# EAGLE design vr01-revC (EAGLE 9.6.2)
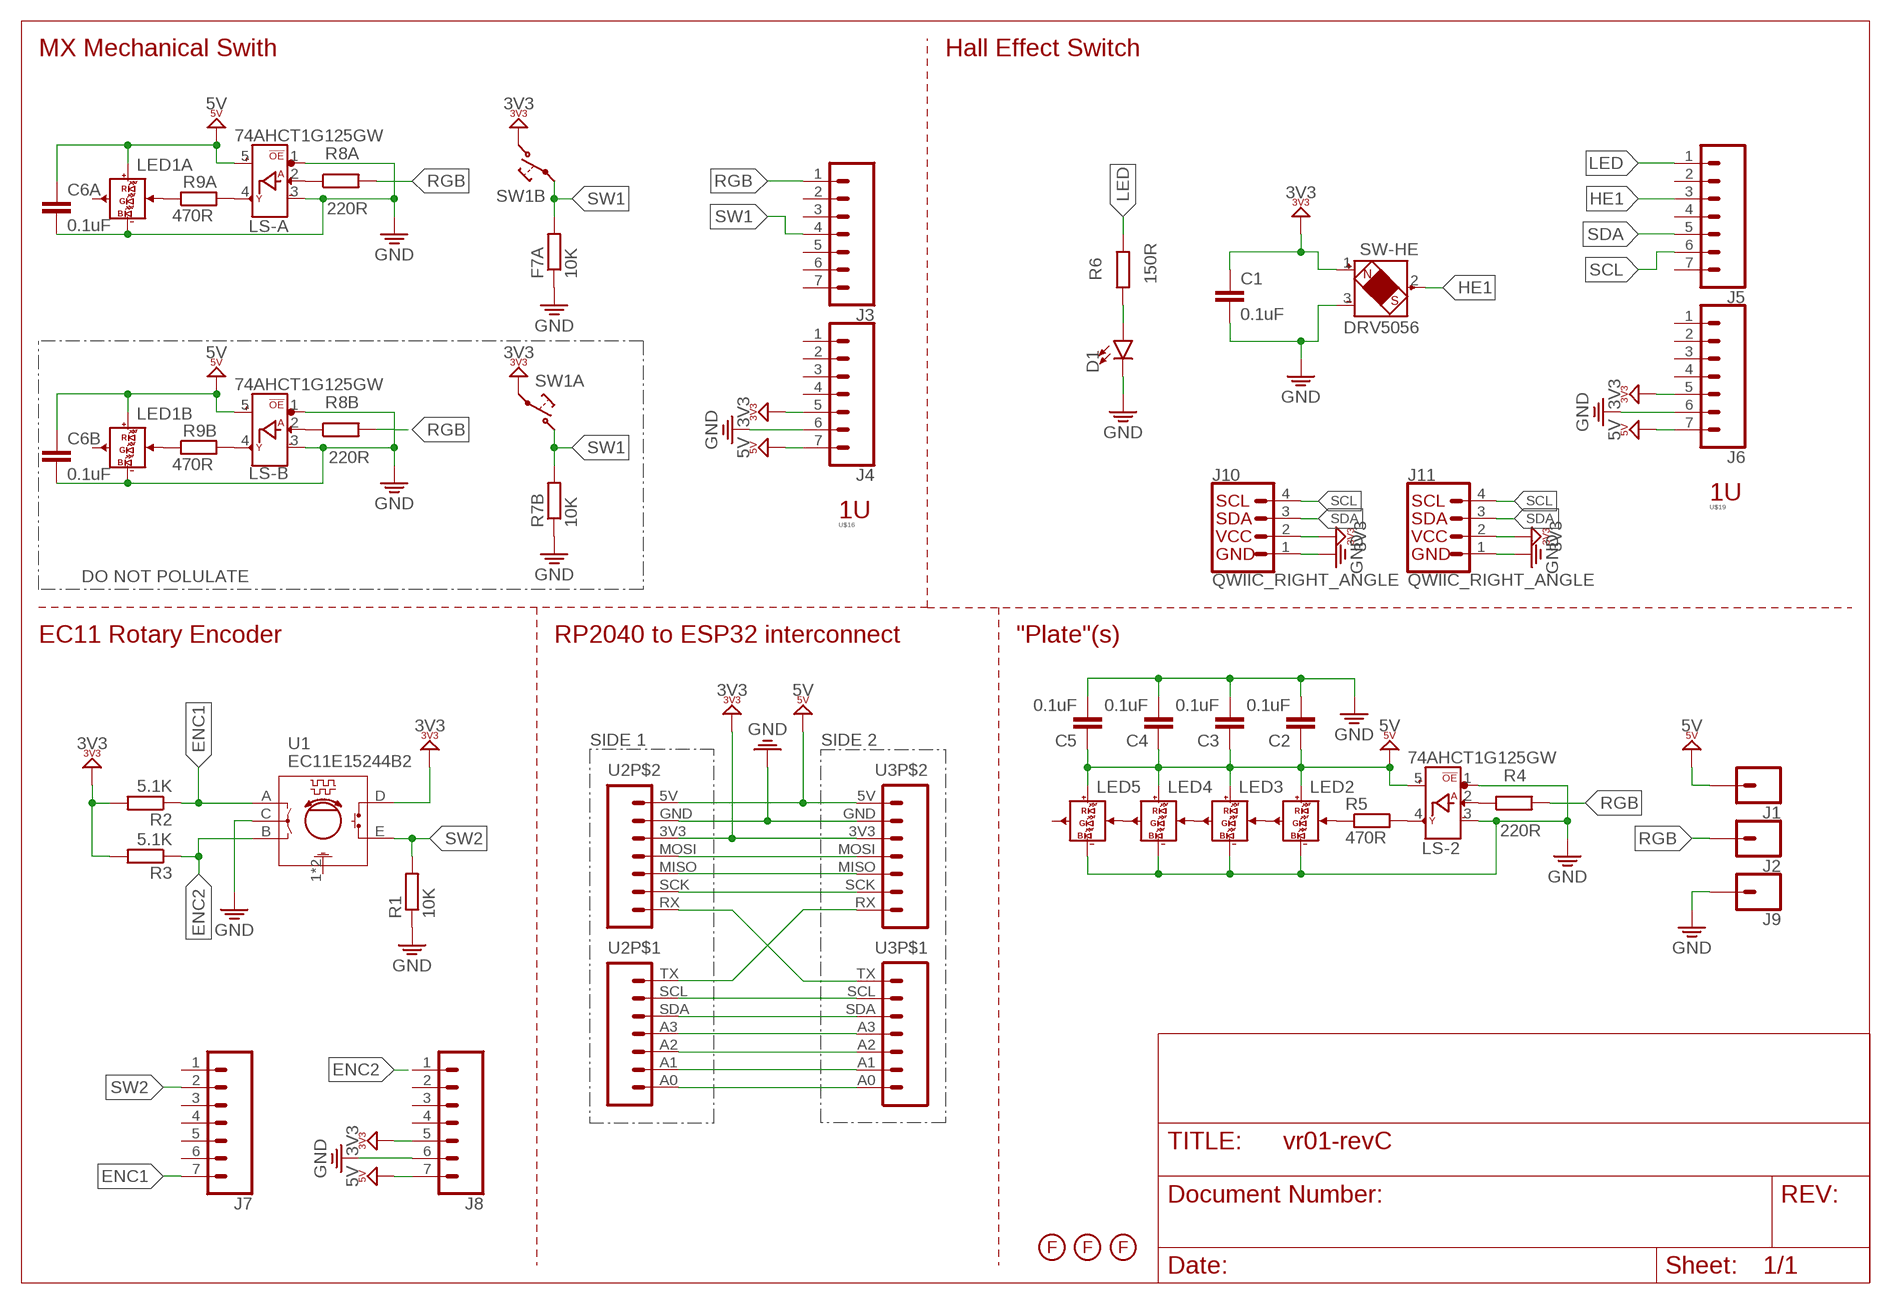
[diagram p0: schematic, sheet 1]

## Parts
C1  0.1uF  C-EUC0603  [C0603]
C2  0.1uF  C-EUC0603  [C0603]
C3  0.1uF  C-EUC0603  [C0603]
C4  0.1uF  C-EUC0603  [C0603]
C5  0.1uF  C-EUC0603  [C0603]
C6A  0.1uF  C-EUC0603  [C0603]
C6B  0.1uF  C-EUC0603  [C0603]
D1  LED1206-BOTTOM  [LED-1206-BOTTOM]
F7A  10K  R-EU_R0603  [R0603]
J1  CONN_01PTH_NO_SILK_STAND  [1X01_NO_SILK_STAND]
J2  CONN_01PTH_NO_SILK_STAND  [1X01_NO_SILK_STAND]
J3  CONN_07  [1X07]
J4  CONN_07  [1X07]
J5  CONN_07  [1X07]
J6  CONN_07  [1X07]
J7  CONN_07  [1X07]
J8  CONN_07  [1X07]
J9  CONN_01PTH_NO_SILK_STAND  [1X01_NO_SILK_STAND]
J10  QWIIC_RIGHT_ANGLE  QWIIC_CONNECTORJS-1MM  [JST04_1MM_RA]
J11  QWIIC_RIGHT_ANGLE  QWIIC_CONNECTORJS-1MM  [JST04_1MM_RA]
LED1A  SK6812-MINI-ESK6812MINI-E  [SK6812-E-MILL_V2]
LED1B  SK6812-MINI-ESK6812MINI-E  [SK6812-E-MILL_V2]
LED2  SK6812-MINI-ESK6812MINI-E  [SK6812-E-MILL_V2]
LED3  SK6812-MINI-ESK6812MINI-E  [SK6812-E-MILL_V2]
LED4  SK6812-MINI-ESK6812MINI-E  [SK6812-E-MILL_V2]
LED5  SK6812-MINI-ESK6812MINI-E  [SK6812-E-MILL_V2]
LS-2  74AHCT1G125GW  [SOT353]
LS-A  74AHCT1G125GW  [SOT353]
LS-B  74AHCT1G125GW  [SOT353]
R1  10K  R-EU_R0603  [R0603]
R2  5.1K  R-EU_R0603  [R0603]
R3  5.1K  R-EU_R0603  [R0603]
R4  220R  R-EU_R0603  [R0603]
R5  470R  R-EU_R0603  [R0603]
R6  150R  R-EU_R0603  [R0603]
R7B  10K  R-EU_R0603  [R0603]
R8A  220R  R-EU_R0603  [R0603]
R8B  220R  R-EU_R0603  [R0603]
R9A  470R  R-EU_R0603  [R0603]
R9B  470R  R-EU_R0603  [R0603]
SW1A  MX-5-PIN-HOTSWAP-VIANO-SILK  [MX-5-PIN-HOTSWAP-VIA-NS]
SW1B  MX-5-PIN-HOTSWAP-VIANO-SILK  [MX-5-PIN-HOTSWAP-VIA-NS]
SW-HE  DRV5056  HE-2-PIN-HOTSWAP  [HE-2-PIN-HOTSWAP-NS]
U1  EC11E15244B2  [ROTARY_EC11E]
U2  MOUDLE-SEEEDUINO-XIAOSMD  [MOUDLE14P-SMD-2.54-21X17.8MM]
U3  MOUDLE-SEEEDUINO-XIAOSMD  [MOUDLE14P-SMD-2.54-21X17.8MM]
U$2  FIDUCIAL  [FIDUCIAL]
U$4  FIDUCIAL  [FIDUCIAL]
U$5  FIDUCIAL  [FIDUCIAL]
U$16  MX-FPRINT-100U-DOC  [MX-FPRINT-DOC-100U]
U$19  MX-FPRINT-100U-DOC  [MX-FPRINT-DOC-100U]

## Nets
ENC1: J7.7 R2.1 U1.A
ENC2: J8.1 R3.1 U1.B
GND: C1.2 C2.2 C3.2 C4.2 C5.2 C6A.2 C6B.2 D1.C F7A.1 J4.6 J6.6 J8.6 J9.1 J10.1 J11.1 LED1A.3-GND(GND) LED1B.3-GND(GND) LED2.3-GND(GND) LED3.3-GND(GND) LED4.3-GND(GND) LED5.3-GND(GND) LS-2.1(!OE) LS-2.3(3_GND) LS-A.1(!OE) LS-A.3(3_GND) LS-B.1(!OE) LS-B.3(3_GND) R1.1 R7B.1 SW-HE.3(GND) U1.C U2.GND U3.GND
HE1: J5.3 SW-HE.2(OUT)
LED: J5.1 R6.2
N$1: U2.RX U3.TX
N$2: U2.SCL U3.SCL
N$3: U2.SDA U3.SDA
N$4: U2.A3 U3.A3
N$5: U2.A2 U3.A2
N$6: U2.A1 U3.A1
N$7: U2.A0 U3.A0
N$8: U2.TX U3.RX
N$9: D1.A R6.1
N$10: LED1A.4-DIN(DIN) R9A.1
N$11: LS-A.4(Y_DOUT) R9A.2
N$12: LED1B.4-DIN(DIN) R9B.1
N$13: LS-B.4(Y_DOUT) R9B.2
N$14: LS-B.2(A_DIN) R8B.1
N$15: LS-A.2(A_DIN) R8A.1
N$17: U2.MOSI U3.MOSI
N$18: U2.MISO U3.MISO
N$19: U2.SCK U3.SCK
N$25: LED2.4-DIN(DIN) R5.1
N$26: LS-2.4(Y_DOUT) R5.2
N$27: LS-2.2(A_DIN) R4.1
N$28: LED2.2-DOUT(DOUT) LED3.4-DIN(DIN)
N$29: LED3.2-DOUT(DOUT) LED4.4-DIN(DIN)
N$30: LED4.2-DOUT(DOUT) LED5.4-DIN(DIN)
RGB: J2.1 J3.1 R4.2 R8A.2 R8B.2
SCL: J5.6 J10.4 J11.4
SDA: J5.5 J10.3 J11.3
SW1: F7A.2 J3.4 R7B.2 SW1A.1@1 SW1A.1@2 SW1B.2@1 SW1B.2@2
SW2: J7.2 R1.2 U1.E
VCC3: C1.1 J4.5 J6.5 J8.5 J10.2 J11.2 R2.2 R3.2 SW1A.2@1 SW1A.2@2 SW1B.1@1 SW1B.1@2 SW-HE.1(VDD) U1.D U2.3V3 U3.3V3 ; supply symbol labelled 3V3
VCC5: C2.1 C3.1 C4.1 C5.1 C6A.1 C6B.1 J1.1 J4.7 J6.7 J8.7 LED1A.1-VDD(VDD) LED1B.1-VDD(VDD) LED2.1-VDD(VDD) LED3.1-VDD(VDD) LED4.1-VDD(VDD) LED5.1-VDD(VDD) LS-2.5(5_VCC) LS-A.5(5_VCC) LS-B.5(5_VCC) U2.5V U3.5V ; supply symbol labelled 5V
Unconnected: J3.2 J3.3 J3.5 J3.6 J3.7 J4.1 J4.2 J4.3 J4.4 J5.2 J5.4 J5.7 J6.1 J6.2 J6.3 J6.4 J7.1 J7.3 J7.4 J7.5 J7.6 J8.2 J8.3 J8.4 LED1A.2-DOUT(DOUT) LED1B.2-DOUT(DOUT) LED5.2-DOUT(DOUT) U1.1(GND) U1.2(GND)

## Notes on the sheet
- MX Mechanical Swith | Hall Effect Switch
- DO NOT POLULATE
- EC11 Rotary Encoder | RP2040 to ESP32 interconnect | "Plate"(s)
- SIDE 1 | SIDE 2

## Library data of the parts
C1-C5 C6A C6B = rcl:C-EU: CAPACITOR, European symbol; SPICEPREFIX: C
D1 = SparkFun-LED:LED: LED (Generic) Standard schematic elements and footprints for 5mm, 3mm, 1206, and 0603 sized LEDs. Generic LEDs with no color specified.
F7A R1-R6 R7B R8A R8B R9A R9B = rcl:R-EU_: RESISTOR, European symbol; SPICEPREFIX: R
J1 J2 J9 = SparkFun-Connectors:CONN_01: Single connection point. Often used as Generic Header-pin footprint for 0.1 inch spaced/style header connections On any of the 0.1 inch spaced packages, you can populate with these: Break Away Headers - Straight <https://www.sparkfun.com/products/116> (PRT-00116) Break Away Male Headers - Right Angle <https://www.sparkfun.com/products/553> (PRT-00553) Female Headers <https://www.sparkfun.com/products/115> (PRT-00115) Break Away Headers - Machine Pin <https://www.sparkfun.com/products/117> (PRT-00117) Break Away Female Headers - Swiss Machine Pin <https://www.sparkfun.com/products/743> (PRT-00743) This device is also useful as a general connection point to wire up your design to another part of your project. Our various solder wires solder well into these plated through hole pads. Hook-Up Wire - Assortment (Stranded, 22 AWG) <https://www.sparkfun.com/products/11375> (PRT-11375) Hook-Up Wire - Assortment (Solid Core, 22 AWG) <https://www.sparkfun.com/products/11367> (PRT-11367) View the entire wire category on our website here <https://www.sparkfun.com/categories/141> Special notes: SMTSO-256-ET is a "flush mount" nut for a 4-40 screw. We mostly use this on specialty testbeds; it is a nice way to connect hardware to your PCB at an adjustable hieght. Also note, the SNAP packages are for using a snappable style connector. We sell a baggie of snaps and they are also used on two LilyPad designs: Snap Assortment - 30 pack (male and female) <https://www.sparkfun.com/products/11347> (DEV-11347) LilyPad Arduino SimpleSnap <https://www.sparkfun.com/products/10941> (DEV-10941) LilyPad SimpleSnap Protoboard <https://www.sparkfun.com/products/10940> (DEV-10940)
J3-J8 = SparkFun-Connectors:CONN_07: Multi connection point. Often used as Generic Header-pin footprint for 0.1 inch spaced/style header connections On any of the 0.1 inch spaced packages, you can populate with these: Break Away Headers - Straight <https://www.sparkfun.com/products/116> (PRT-00116) Break Away Male Headers - Right Angle <https://www.sparkfun.com/products/553> (PRT-00553) Female Headers <https://www.sparkfun.com/products/115> (PRT-00115) Break Away Headers - Machine Pin <https://www.sparkfun.com/products/117> (PRT-00117) Break Away Female Headers - Swiss Machine Pin <https://www.sparkfun.com/products/743> (PRT-00743) For SCREWTERMINALS and SPRING TERMINALS visit here: Screw Terimnals on SparkFun.com <https://www.sparkfun.com/search/results?term=Screw+Terminals> (5mm/3.5mm/2.54mm spacing) This device is also useful as a general connection point to wire up your design to another part of your project. Our various solder wires solder well into these plated through hole pads. Hook-Up Wire - Assortment (Stranded, 22 AWG) <https://www.sparkfun.com/products/11375> (PRT-11375) Hook-Up Wire - Assortment (Solid Core, 22 AWG) <https://www.sparkfun.com/products/11367> (PRT-11367) View the entire wire category on our website here <https://www.sparkfun.com/categories/141> Special notes: Molex polarized connector foot print use with SKU : PRT-08231 with associated crimp pins and housings. 1MM SMD Version SKU: PRT-10208 NOTES ON THE VARIANTS LOCK and LOCK_LONGPADS... This footprint was designed to help hold the alignment of a through-hole component (i.e. 6-pin header) while soldering it into place. You may notice that each hole has been shifted either up or down by 0.005 of an inch from it's more standard position (which is a perfectly straight line). This slight alteration caused the pins (the squares in the middle) to touch the edges of the holes. Because they are alternating, it causes a "brace" to hold the component in place. 0.005 has proven to be the perfect amount of "off-center" position when using our standard breakaway headers. Although looks a little odd when you look at the bare footprint, once you have a header in there, the alteration is very hard to notice. Also,if you push a header all the way into place, it is covered up entirely on the bottom side.
J10 J11 = tecsmith_custom_nick_nacks:QWIIC_CONNECTOR: SparkFun I2C Standard Qwiic Connector An SMD 1mm pitch JST connector makes it easy and quick (get it? Qwiic?) to connect I2C devices to each other. The Qwiic system <http://www.sparkfun.com/qwiic> enables fast and solderless connection between popular platforms and various sensors and actuators. We carry 200mm <https://www.sparkfun.com/products/14204>, 100mm <https://www.sparkfun.com/products/14205>, 50mm <https://www.sparkfun.com/products/14206>, and breadboard friendly <https://www.sparkfun.com/products/14207> Qwiic cables. We also offer 10 pcs strips <https://www.sparkfun.com/products/14323> the SMD connectors.; PROD_ID: CONN-13694
LED1A LED1B LED2-LED5 = tecsmith_keyboards:SK6812-MINI-E
LS-2 LS-A LS-B = tecsmith_keyboards:74AHCT1G125GW
SW1A SW1B = tecsmith_keyboards:MX-5-PIN-HOTSWAP-VIA
SW-HE = tecsmith_keyboards:HE-2-PIN-HOTSWAP
U1 = tecsmith_keyboards:EC11E15244B2
U2 U3 = tecsmith_seeedstudio_xiao:MOUDLE-SEEEDUINO-XIAO
U$2 U$4 U$5 = tecsmith_custom_nick_nacks:FIDUCIAL
U$16 U$19 = tecsmith_keyboards:MX-FPRINT-100U

## Net classes
1 power: width 0.305 mm
2 gnd: width 0.254 mm

## Board
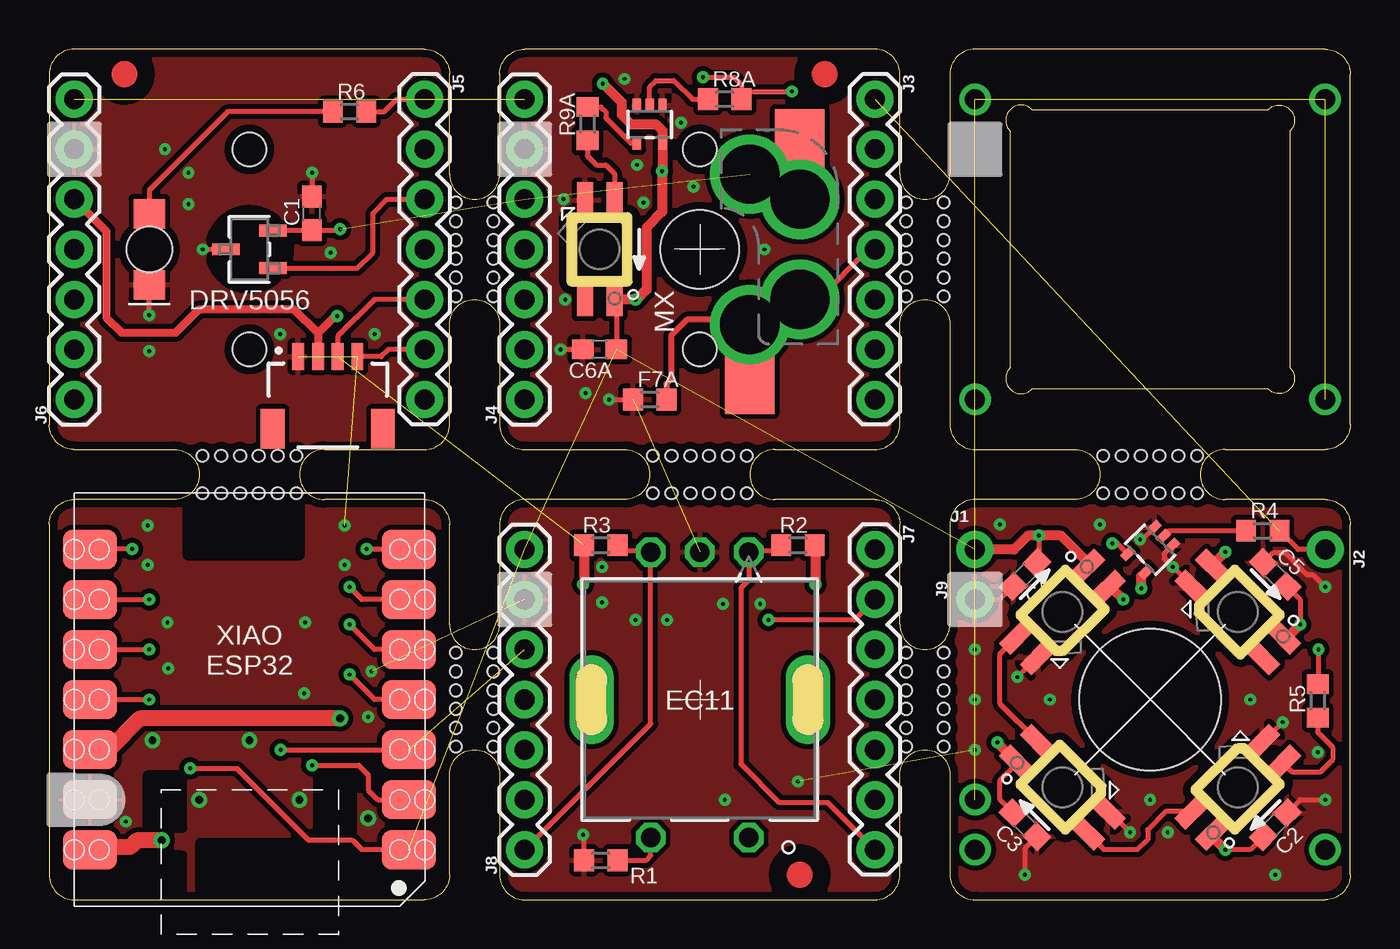
[diagram p1: board, top side]
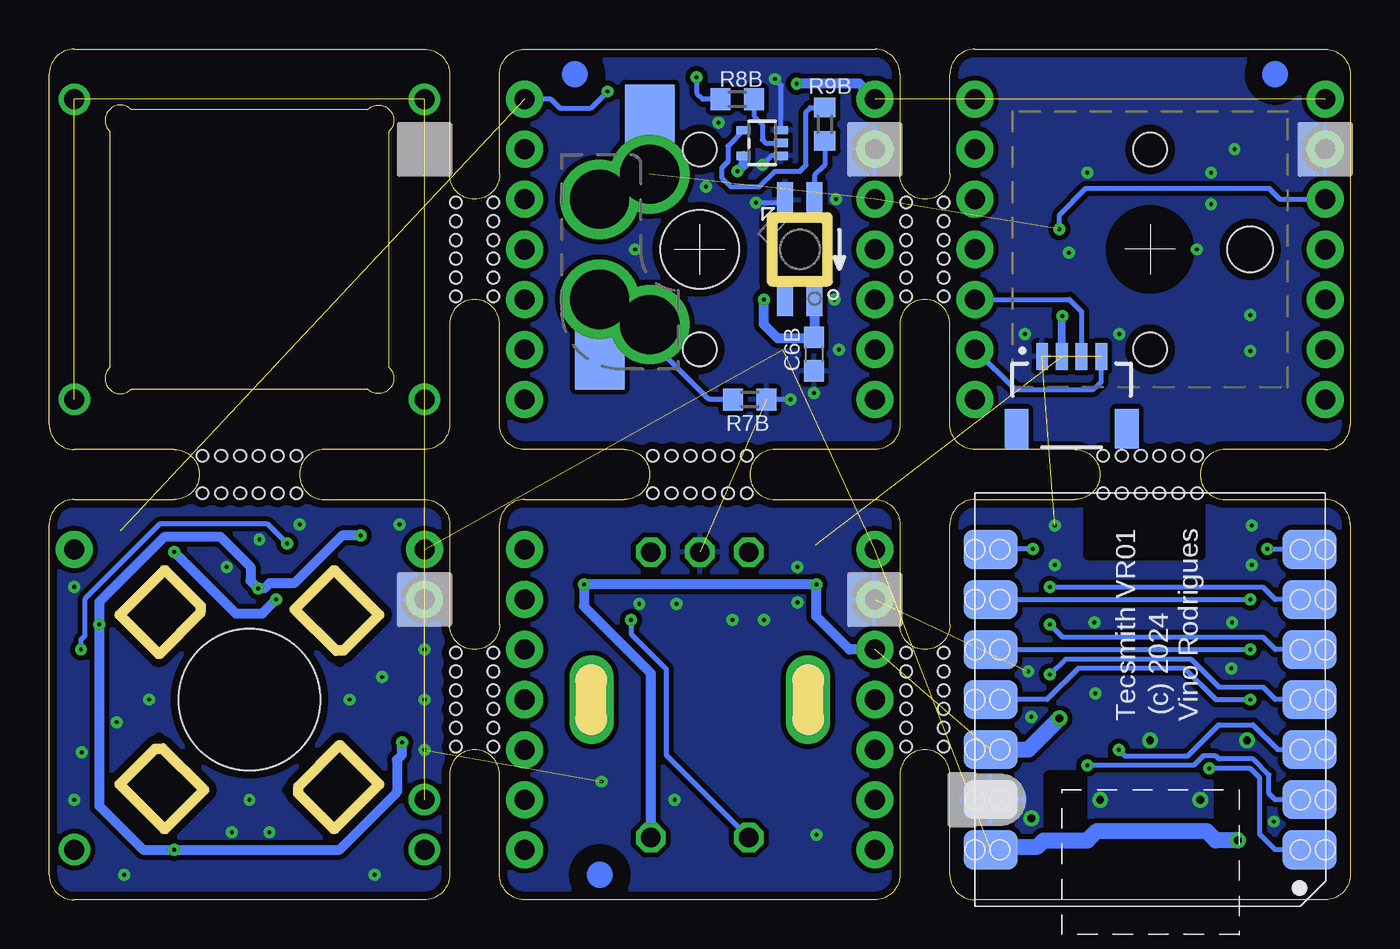
[diagram p2: board, bottom side, seen from below]

Size 66.04 x 43.18 mm. Coordinates in mm from the lower left corner, seen from the top.
Outline: 1.27,0 19.05,0 arc90 20.32,1.27 20.32,6.35 arc-180 22.86,6.35 22.86,1.27 arc90 24.13,0 41.91,0 arc90 43.18,1.27 43.18,6.35 arc-180 45.72,6.35 45.72,1.27 arc90 46.99,0 64.77,0 arc90 66.04,1.27 66.04,19.05 arc90 64.77,20.32 59.69,20.32 arc-180 59.69,22.86 64.77,22.86 arc90 66.04,24.13 66.04,41.91 arc90 64.77,43.18 46.99,43.18 arc90 45.72,41.91 45.72,36.83 arc-180 43.18,36.83 43.18,41.91 arc90 41.91,43.18 24.13,43.18 arc90 22.86,41.91 22.86,36.83 arc-180 20.32,36.83 20.32,41.91 arc90 19.05,43.18 1.27,43.18 arc90 0,41.91 0,24.13 arc90 1.27,22.86 6.35,22.86 arc-180 6.35,20.32 1.27,20.32 arc90 0,19.05 0,1.27 arc90 1.27,0
Outline: 20.32,13.97 20.32,19.05 arc90 19.05,20.32 13.97,20.32 arc-180 13.97,22.86 19.05,22.86 arc90 20.32,24.13 20.32,29.21 arc-180 22.86,29.21 22.86,24.13 arc90 24.13,22.86 29.21,22.86 arc-180 29.21,20.32 24.13,20.32 arc90 22.86,19.05 22.86,13.97 arc-180 20.32,13.97
Outline: 43.18,13.97 43.18,19.05 arc90 41.91,20.32 36.83,20.32 arc-180 36.83,22.86 41.91,22.86 arc90 43.18,24.13 43.18,29.21 arc-180 45.72,29.21 45.72,24.13 arc90 46.99,22.86 52.07,22.86 arc-180 52.07,20.32 46.99,20.32 arc90 45.72,19.05 45.72,13.97 arc-180 43.18,13.97
Outline: 49.88,40.12 61.88,40.12 arc-180 62.98,39.02 62.98,27.02 arc-180 61.88,25.92 49.88,25.92 arc-180 48.78,27.02 48.78,39.02 arc-180 49.88,40.12
Copper layers (1*16): Top 0.035mm / dielectric 1.5mm / Bottom 0.035mm
Design rules "default *": minimum track width 6mil, minimum drill 0.2mm, track to track 6mil, track to pad 6mil, pad to pad 6mil, via to via 6mil, smd to smd 6mil, copper to edge 0.4mm, drill to drill 0.2mm, minimum pad ring 10mil, minimum via ring 8mil, stop-mask expansion 4mil, vias tented up to drill 0mil, thermal gap 10mil
Holes 7.2 mm at 55.88,10.16
Holes 0.6 mm at 56.36,22.54 57.31,22.54 58.26,22.54 55.4,22.54 54.45,22.54 53.5,22.54 53.5,20.64 54.45,20.64 55.4,20.64 56.36,20.64 57.31,20.64 58.26,20.64 45.4,10.64 45.4,11.59 45.4,12.54 45.4,9.68 45.4,8.73 45.4,7.78 43.5,7.78 43.5,8.73 43.5,9.68 43.5,10.64 43.5,11.59 43.5,12.54 22.54,9.68 22.54,8.73 22.54,7.78 22.54,10.64 22.54,11.59 22.54,12.54 20.64,12.54 20.64,11.59 20.64,10.64 20.64,9.68 20.64,8.73 20.64,7.78 10.64,22.54 11.59,22.54 12.54,22.54 9.68,22.54 8.73,22.54 7.78,22.54 7.78,20.64 8.73,20.64 9.68,20.64 10.64,20.64 11.59,20.64 12.54,20.64 33.5,22.54 34.45,22.54 35.4,22.54 32.54,22.54 31.59,22.54 30.64,22.54 30.64,20.64 31.59,20.64 32.54,20.64 33.5,20.64 34.45,20.64 35.4,20.64 20.64,33.5 20.64,34.45 20.64,35.4 20.64,32.54 20.64,31.59 20.64,30.64 22.54,30.64 22.54,31.59 22.54,32.54 22.54,33.5 22.54,34.45 22.54,35.4 45.4,33.5 45.4,34.45 45.4,35.4 45.4,32.54 45.4,31.59 45.4,30.64 43.5,33.5 43.5,34.45 43.5,35.4 43.5,32.54 43.5,31.59 43.5,30.64

### Footprints (pad centres in the part's own frame; a part is rotated, then mirrored left to right if it is on the bottom)
C0603 = smd 1.1 x 1: 1 -0.85,0; 2 0.85,0
LED-1206-BOTTOM = smd 1.5 x 1.6: A -1.8,0; C 1.8,0 | hole 2.3: 0,0
R0603 = smd 1 x 1.1: 1 -0.85,0; 2 0.85,0
1X01_NO_SILK_STAND = drill 1.016 pad 1.88: 1 0,0
1X07 = drill 1.016 pad 1.88: 1 0,0; 2 2.54,0; 3 5.08,0; 4 7.62,0; 5 10.16,0; 6 12.7,0; 7 15.24,0
JST04_1MM_RA = smd 0.6 x 1.35: 1 -1.5,0; 2 -0.5,0; 3 0.5,0; 4 1.5,0 | smd 1.2 x 2: NC1 2.8,-3.675; NC2 -2.8,-3.675
SK6812-E-MILL_V2 = smd 1.8 x 0.82 bottom: 1-VDD 2.5,-0.75; 2-DOUT 2.5,0.75; 3-GND -2.5,0.75; 4-DIN -2.5,-0.75
SOT353 = smd 0.42 x 0.7: 1 -0.65,-0.95; 2 0,-0.95; 3 0.65,-0.95; 4 0.65,0.95; 5 -0.65,0.95
MX-5-PIN-HOTSWAP-VIA-NS = smd 3.15 x 2.5 bottom: 1@1 -6.785,2.54; 2@1 5.542,5.08 | drill 3 pad 3.75: 1@2 -3.81,2.54; 2@2 2.54,5.08 | hole 3.988: 0,0 | hole 1.7: -5.08,0; 5.08,0
HE-2-PIN-HOTSWAP-NS = smd 0.6 x 1.4 bottom: 1 0.953,1.194; 2 -0.953,1.194; 3 0,-1.194 | hole 1.7: -5.08,0; 5.08,0
ROTARY_EC11E = drill 1.5 pad 2 long: 1 -5.5,0; 2 5.5,0 | drill 0.991 pad 1.499 octagon: A -2.489,-7.493; B 2.489,-7.493; C 0,-7.493; D -2.489,7.01; E 2.489,7.01 | hole 1.5: -5.5,1; -5.5,-1; 5.5,1; 5.5,-1
MOUDLE14P-SMD-2.54-21X17.8MM = smd 2 x 2.75: 3V3 2.54,-8.082; 5V 7.62,-8.082; A0 7.62,8.082; A1 5.08,8.082; A2 2.54,8.082; A3 0,8.082; GND 5.08,-8.082; MISO -2.54,-8.082; MOSI 0,-8.082; RX -7.62,-8.082; SCK -5.08,-8.082; SCL -5.08,8.082; SDA -2.54,8.082; TX -7.62,8.082

### Placement (x,y rotation side)
C1  13.34,34.85 90 top
C2  62.23,3.81 45 top
C3  49.53,3.81 315 top
C4  49.53,16.51 225 top
C5  62.23,16.51 135 top
C6A  27.94,27.94 180 top
C6B  27.23,27.7 270 bottom
D1  5.08,33.02 270 top
F7A  30.48,25.4 0 top
J1  46.99,17.78 0 top
J2  64.77,17.78 0 top
J3  41.91,40.64 270 top
J4  24.13,25.4 90 top
J5  19.05,40.64 270 top
J6  1.27,25.4 90 top
J7  41.91,17.78 270 top
J8  24.13,2.54 90 top
J9  46.99,15.24 0 top
J10  14.14,27.58 0 top
J11  14.14,27.58 0 bottom
LED1A  27.94,33.02 270 bottom
LED1B  27.94,33.02 270 top
LED2  60.33,5.71 315 bottom
LED3  51.44,5.71 45 bottom
LED4  51.44,14.61 135 bottom
LED5  60.33,14.61 225 bottom
LS-2  55.88,17.78 135 top
LS-A  30.48,39.37 180 top
LS-B  29.84,38.42 90 bottom
R1  28,2 0 top
R2  38,18 0 top
R3  28,18 180 top
R4  61.59,18.73 0 top
R5  64.39,10.1 90 top
R6  15.24,40.01 0 top
R7B  30.48,25.4 180 bottom
R8A  34.29,40.64 0 top
R8B  31.11,40.64 180 bottom
R9A  27.32,39.4 90 top
R9B  26.67,39.37 90 bottom
SW1A  33.02,33.02 90 bottom
SW1B  33.02,33.02 270 top
SW-HE  10.16,33.02 90 bottom
U1  33.02,10.16 180 top
U2  10.16,10.16 270 bottom
U3  10.16,10.16 270 top
U$2  3.81,41.91 0 top
U$4  39.37,41.91 0 top
U$5  38.1,1.27 0 top
U$16  33.02,10.16 0 top
U$19  33.02,33.02 0 top

### Tracks (layer width: path | path; a pad name or v marks a point on that pad's centre or on a via)
ENC1
  Top 0.254: R2.1 36.85,17.7 35.56,17.7 U1.A 35.51,16.22 35.11,15.83 35.11,6.89 37.08,4.92 39.53,4.92 J7.7
ENC2
  Top 0.254: R3.1 29.15,17.7 30.48,17.7 U1.B 30.53,8.94 J8.1
GND  (via drill 0.2 pad 0.4, 0.4 pad 0.8)  (5 unrouted)
  Top 0.254: R1.1 27.15,3.25 v27.1,3.3 | v28.42,25.4 F7A.1 | LED5.3-GND 58.03,15.89 v57.02,16.89 56.59,17.32 56.59,17.57 LS-2.1 | v49.15,11.3 50.15,12.31 LED4.3-GND | v55.37,18.29 55.47,18.29 LS-2.3 | v62.61,9.02 61.61,8.01 LED2.3-GND | LED3.3-GND 53.81,4.48 v54.86,3.43 | v7.78,33.02 SW-HE.3 | v13.34,36.91 C1.2 | v5.08,29.69 D1.C | C6A.2 v25.96,27.94 | C5.2 62.14,17.62 62.71,17.62 63.82,16.51 64.14,16.51 v64.77,15.88 | C2.2 63.5,5.08 v64.77,5.08 | C3.2 49.53,2.61 v49.53,1.27 | C4.2 48.26,15.24 J9.1
  Top 0.508: 2.54,5.08 U3.GND
  Bottom 0.254: v28.42,25.4 F7A.1 | LED1B.3-GND 28.81,35.4 v30.16,35.4 | LS-B.1 29.38,37.77 v29.84,37.31 | LS-B.3 28.89,41.36 v29.21,41.67
  other vias: 16.19,4.13 5.24,8.1 10.16,8.1 12.7,5.08 7.62,5.08 12.94,10.48 6.03,11.75 13,14.08 5,17 5,19 15,19 6,14.08 15,17 55.88,5.08 62.23,1.27 60.96,10.16 50.8,10.16 46.99,7.62 46.99,10.16 46.99,12.7 48.26,19.05 53.34,19.05 56.77,3.43 64.39,7.49 36.09,15.02 28.05,15.1 34.19,15.02 34.29,5.08 29.75,14.2 31.35,14.2 28.05,16.9 38,6 26.11,35.56 26.19,30.48 32.07,39.45 32.7,36.2 16.35,11.59 16.19,9.29 3.89,3.97 5.87,38.1 7.06,36.91 7.06,35.32 14.29,32.86 27.23,25.72 11.71,28.72 16.51,28.72 5.08,27.85 36.3,33.02
  pour Top (isolate 0.254): 0,0 66.04,0 66.04,20.32 43.18,20.32 43.18,43.18 0,43.18
  pour Bottom (isolate 0.254): 0,0 66.04,0 66.04,20.32 43.18,20.32 43.18,43.18 0,43.18
HE1
  Top 0.254: SW-HE.2 15.64,32.07 16.43,32.86 16.43,34.85 17.14,35.56 J5.3
LED
  Top 0.254: R6.2 16.99,40.01 17.62,40.64 J5.1
N$1  (via drill 0.2 pad 0.4)
  Top 0.254: U3.TX 16.12,17.78 v16.1,17.8
  Bottom 0.254: v16.1,17.8 18.22,17.8 U3.TX
N$2  (via drill 0.2 pad 0.4)
  Top 0.254: U3.SCL 15.88,15.24 v15.24,15.88
  Bottom 0.254: U2.SCL 3.81,15.24 4.45,15.88 v15.24,15.88
N$3  (via drill 0.2 pad 0.4)
  Top 0.254: U3.SDA 16.51,12.7 v15.24,13.97
  Bottom 0.254: U2.SDA 3.81,12.7 4.45,13.34 14.61,13.34 v15.24,13.97
N$4  (via drill 0.2 pad 0.4)
  Top 0.254: U3.A3 16.51,10.16 v15.24,11.43
  Bottom 0.254: U2.A3 3.81,10.16 4.45,10.79 6.67,10.79 8.1,12.22 14.45,12.22 v15.24,11.43
N$5  (via drill 0.2 pad 0.4)
  Top 0.254: v11.75,7.62 U3.A2
  Bottom 0.254: U2.A2 3.67,7.62 4.93,8.89 6.67,8.89 8.26,7.3 11.43,7.3 v11.75,7.62
N$6  (via drill 0.2 pad 0.4)
  Top 0.254: U3.A1 16.67,5.08 16.19,5.56 16.19,6.35 15.72,6.83 v13.34,6.83
  Bottom 0.254: U2.A1 3.81,5.08 4.13,5.4 4.13,6.35 4.92,7.14 6.67,7.14 6.83,7.3 7.46,7.3 7.94,6.83 v13.34,6.83
N$7  (via drill 0.2 pad 0.4)
  Top 0.254: U3.A0 15.88,2.54 15.4,3.02 13.18,3.02 9.53,6.67 v7.14,6.67
  Bottom 0.254: U2.A0 3.81,2.54 4.6,3.33 4.6,6.19 5.08,6.67 v7.14,6.67
N$8  (via drill 0.2 pad 0.4)
  Top 0.254: v4.2,17.8 2.1,17.8 U2.TX
  Bottom 0.254: U2.TX 4.18,17.78 v4.2,17.8
N$9
  Top 0.254: R6.1 9.05,40.01 5.08,36.04 D1.A
N$10
  Top 0.254: R9A.1 27.32,37.76 27.78,37.31 28.26,37.31 28.69,36.87 LED1A.4-DIN
N$11
  Top 0.254: R9A.2 28.02,40.25 28.26,40.01 28.26,39.69 29.52,38.42 LS-A.4
N$12
  Bottom 0.254: R9B.1 26.67,37.31 27.19,36.79 LED1B.4-DIN
N$13
  Bottom 0.254: LS-B.4 31.59,38.27 31.59,37.47 31.91,37.15 31.91,36.67 31.43,36.2 30,36.2 29.21,36.99 27.94,36.99 27.62,37.31 27.62,40.01 27.41,40.22 R9B.2
N$14
  Bottom 0.254: R8B.1 30.27,39.79 29.84,39.37 29.84,38.58 29.69,38.42 LS-B.2
N$15
  Top 0.254: LS-A.2 30.48,41.27 30.8,41.59 31.69,41.59 32.65,40.64 R8A.1
N$17  (via drill 0.2 pad 0.4)
  Top 0.254: U3.MOSI v5.08,10.16
  Bottom 0.254: U2.MOSI 15.4,10.16 13.81,11.75 8.41,11.75 6.83,10.16 v5.08,10.16
N$18  (via drill 0.2 pad 0.4)
  Top 0.254: U3.MISO v5.08,12.7
  Bottom 0.254: U2.MISO v5.08,12.7
N$19  (via drill 0.2 pad 0.4)
  Top 0.254: U3.SCK v5.08,15.24
  Bottom 0.254: U2.SCK v5.08,15.24
N$22  (via drill 1 pad 1.6)
  other vias: 46.99,2.54
N$23  (via drill 1 pad 1.6)
  other vias: 64.77,2.54
N$24  (via drill 1 pad 1.6)  (4 unrouted)
  other vias: 46.99,5.08 64.77,25.4 64.77,40.64 46.99,40.64 46.99,25.4
N$25
  Top 0.254: R5.1 64.39,8.51 65.15,7.75 65.15,7.11 64.52,6.48 63.1,6.48 LED2.4-DIN
N$26  (via drill 0.2 pad 0.4)
  Top 0.254: LS-2.4 54.22,18.1 v53.98,18.1 | v64.43,12.7 64.43,10.99 R5.2
  Bottom 0.254: v53.98,18.1 54.95,19.07 60.43,19.07 64.24,15.26 64.24,13.4 64.43,13.21 v64.43,12.7
N$27
  Top 0.254: R4.1 56.83,18.73 LS-2.2
N$28
  Top 0.254: LED3.4-DIN 53.55,2.54 55.24,2.54 55.75,3.05 55.75,3.56 56.67,4.48 LED2.2-DOUT
N$29
  Top 0.254: LED3.2-DOUT 48.26,9.95 48.26,12.49 48.37,12.6 48.61,12.84 LED4.4-DIN
N$30  (via drill 0.2 pad 0.4)
  Top 0.508: LED5.4-DIN 59.09,17.05 v59.69,17.65 | LED4.2-DOUT 53.91,15.84 v54.51,15.24
  Bottom 0.508: v59.69,17.65 56.57,14.53 55.22,14.53 v54.51,15.24
RGB  (via drill 0.2 pad 0.4)  (1 unrouted)
  Top 0.254: J2.1 63.4,17.78 R4.2 | v33.18,41.75 34.77,41.75 35.14,41.38 R8A.2 35.54,41.04 v37.7,41.04
  Bottom 0.254: R8B.2 32.86,40.64 33.18,40.96 v33.18,41.75 | v37.7,41.04 38.58,40.16 40.08,40.16 40.56,40.64 J3.1
SCL
  Top 0.254: J5.6 17.22,27.94 | 17.22,27.94 | J10.4 16.85,27.58 17.22,27.94
  Bottom 0.254: J5.6 17,25.89 13.05,25.89 12.64,26.31 J11.4
SDA
  Top 0.254: J10.3 14.64,28.61 16.51,30.48 J5.5
  Bottom 0.254: J5.5 14.25,30.48 13.64,29.87 J11.3
SW1
  Top 0.254: SW1A.1@1 SW1A.1@2 36.83,30.48 SW1B.2@2 39.05,30.48 41.59,33.02 J3.4
  Top 0.305: SW1A.1@2 34.61,29.21 34.37,29.45 32.38,29.45 31.57,28.63 31.57,26.43 31.33,26.19 F7A.2
  Bottom 0.254: SW1B.2@2 SW1B.2@1 | F7A.2 32.54,25.4 35.56,28.42 SW1A.1@2
SW2  (via drill 0.2 pad 0.4)
  Top 0.254: R1.2 30.28,2 30.53,2.25 U1.E | J7.2 40.87,14.2 v36.5,14.2
  Bottom 0.254: v36.5,14.2 36.5,13.5 34.73,11.73 34.73,7.35 U1.E
VCC3  (via drill 0.2 pad 0.4, 0.4 pad 0.8)  (4 unrouted)
  Top 0.254: 27.15,16.05 v27.1,16 | R2.2 38.9,17.95 | SW1A.2@1 SW1A.2@2 36.83,35.56 SW1B.1@2 | v14.76,34.05 14.71,34 C1.1 11.38,34 SW-HE.1
  Top 0.406: J6.5 2.89,33.94 2.89,29.56 3.67,28.79 6.42,28.79 7.62,29.99 12.42,29.99 13.64,28.76 | 13.64,28.76 J10.2 | v14.61,29.63 14.51,29.63 13.64,28.76
  Top 0.508: R3.2 27.15,16.05 | 38.9,17.95 v38.9,16
  Top 0.8: U3.3V3 3.02,7.62 4.6,9.21 v14.76,9.21
  Bottom 0.254: SW1B.1@1 SW1B.1@2 | v14.76,34.05 14.76,34.77 13.41,36.12 4.13,36.12 3.57,35.56 J6.5
  Bottom 0.406: J11.2 14.64,29.6 v14.61,29.63
  Bottom 0.508: J8.5 25.42,12.7 27.1,14.38 v27.1,16 v38.9,16 38.9,14.9 35.51,11.51 U1.D
  Bottom 0.8: U2.3V3 16.35,7.62 v14.76,9.21
VCC5  (via drill 0.2 pad 0.4, 0.4 pad 0.8)  (4 unrouted)
  Top 0.254: LED1A.1-VDD 28.79,30.42 C6A.1 | v50.24,18.49 50.24,17.22 C4.1 | C5.1 63.5,15.24 v63.5,13.97 | C2.1 60.96,2.54 v59.69,2.54 | C3.1 48.26,5.08 48.26,6.08 LED3.1-VDD
  Top 0.508: U3.5V 2.24,2.7 2.88,2.7 | J1.1 48.97,17.78 49.69,18.49 v50.24,18.49 51.36,18.49 52.67,17.18 LED4.1-VDD | v55.44,15.81 55.44,16.42 LS-2.5 | LED1A.1-VDD 28.73,30.48 v29.77,30.48 29.83,30.48 30.32,30.97 30.32,34.13 31.11,34.92 v31.11,36.99 31.13,37 LS-A.5 31.13,39.04 30.8,39.37 29.53,39.37 29.05,39.85 29.05,40.48 v28.1,41.43 | LED1A.1-VDD | LED1A.1-VDD | LED3.1-VDD 48.13,7.96 v48.13,8 | LED5.1-VDD 62.9,13.37 v63.5,13.97 | LED2.1-VDD 59.09,3.14 v59.69,2.54
  Top 0.8: v5.71,3.02 4.45,3.02
  Top 0.813: 4.45,3.02 4.13,2.7 2.88,2.7
  Bottom 0.508: v50.24,18.49 51.19,18.49 53.62,16.07 54.87,16.07 55.12,15.81 v55.44,15.81 55.82,16.19 55.82,16.89 57.33,18.41 60.21,18.41 63.5,15.12 v63.5,13.97 63.5,4.76 61.28,2.54 v59.69,2.54 51.31,2.54 48.39,5.46 48.39,7.11 48.13,7.37 v48.13,8 | J4.7 24.92,41.43 v28.1,41.43 | LS-B.5 30.8,37.29 31.1,36.99 v31.11,36.99 | LED1B.1-VDD 27.19,28.59 C6B.1 27.28,28.5 29.05,28.5 29.77,29.21 v29.77,30.48
  Bottom 0.8: v5.71,3.02 6.83,3.02
  Bottom 0.813: U2.5V 18.08,2.7 15.88,2.7 15.56,3.02 13.34,3.02 12.86,3.49 7.3,3.49 6.83,3.02

### Text on the board
tNames: DRV5056 | MX | XIAO / ESP32 | EC11
bNames: Vino Rodrigues | Tecsmith VR01 | (c) 2024